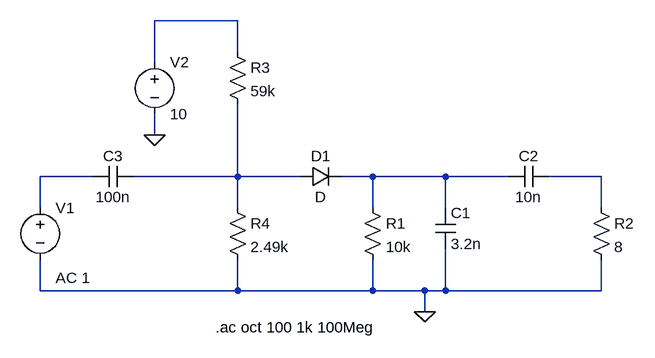
[diagram p0: schematic demod.asc]
demod.asc, the LTspice schematic file:
Version 4
SHEET 1 880 680
WIRE 0 -96 -128 -96
WIRE 0 -48 0 -96
WIRE -128 -32 -128 -96
WIRE -128 80 -128 48
WIRE -224 144 -304 144
WIRE 0 144 0 32
WIRE 0 144 -160 144
WIRE 96 144 0 144
WIRE 208 144 160 144
WIRE 320 144 208 144
WIRE 416 144 320 144
WIRE 560 144 480 144
WIRE -304 192 -304 144
WIRE 0 192 0 144
WIRE 208 192 208 144
WIRE 320 192 320 144
WIRE 560 192 560 144
WIRE -304 320 -304 272
WIRE 0 320 0 272
WIRE 0 320 -304 320
WIRE 208 320 208 272
WIRE 208 320 0 320
WIRE 288 320 208 320
WIRE 320 320 320 256
WIRE 320 320 288 320
WIRE 560 320 560 272
WIRE 560 320 320 320
WIRE 288 352 288 320
FLAG 288 352 0
FLAG -128 80 0
SYMBOL diode 96 160 R270
WINDOW 0 32 32 VTop 2
WINDOW 3 0 32 VBottom 2
SYMATTR InstName D1
SYMBOL res 192 176 R0
SYMATTR InstName R1
SYMATTR Value 10k
SYMBOL cap 304 192 R0
SYMATTR InstName C1
SYMATTR Value 3.2n
SYMBOL cap 480 128 R90
WINDOW 0 0 32 VBottom 2
WINDOW 3 32 32 VTop 2
SYMATTR InstName C2
SYMATTR Value 10n
SYMBOL voltage -304 176 R0
WINDOW 123 24 124 Left 2
WINDOW 39 0 0 Left 0
SYMATTR InstName V1
SYMATTR Value ""
SYMATTR Value2 AC 1
SYMBOL res 544 176 R0
SYMATTR InstName R2
SYMATTR Value 8
SYMBOL res -16 -64 R0
SYMATTR InstName R3
SYMATTR Value 59k
SYMBOL res -16 176 R0
SYMATTR InstName R4
SYMATTR Value 2.49k
SYMBOL voltage -128 -48 R0
WINDOW 123 0 0 Left 0
WINDOW 39 0 0 Left 0
SYMATTR InstName V2
SYMATTR Value 10
SYMBOL cap -160 128 R90
WINDOW 0 0 32 VBottom 2
WINDOW 3 32 32 VTop 2
SYMATTR InstName C3
SYMATTR Value 100n
TEXT -34 376 Left 2 !.ac oct 100 1k 100Meg

The netlist it stands for:
* demod.asc
D1 N003 N004 D
R1 N004 0 10k
C1 N004 0 3.2n
C2 N005 N004 10n
V1 N002 0 AC 1
R2 N005 0 8
R3 N001 N003 59k
R4 N003 0 2.49k
V2 N001 0 10
C3 N003 N002 100n
.model D D
.lib standard.dio
.ac oct 100 1k 100Meg
.backanno
.end